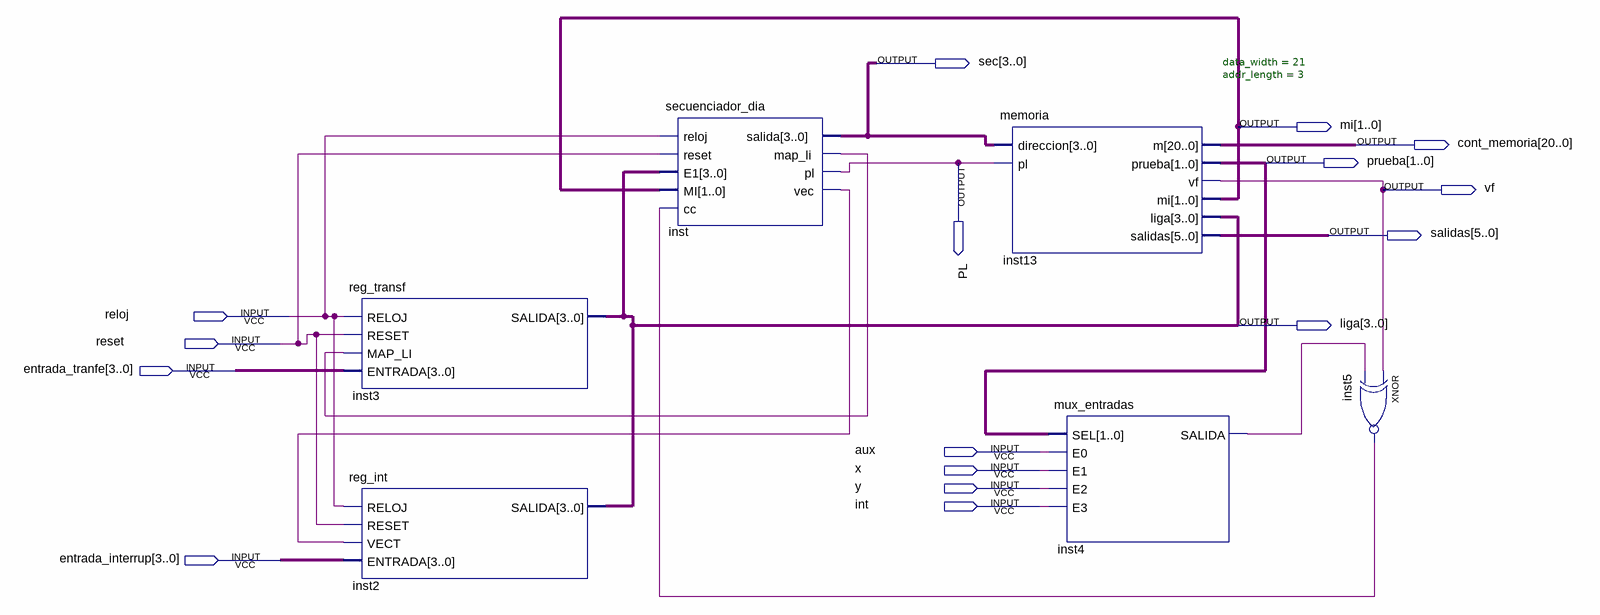
[diagram p0: schematic sheet]
// Quartus schematic practica_6.bdf as structural Verilog: 6 symbols, 16 pins
module practica_6 (
  input  reloj,
  input  reset,
  input  [3:0] entrada_tranfe,
  input  aux,
  input  x,
  input  y,
  input  \int ,
  input  [3:0] entrada_interrup,
  output [3:0] sec,
  output [1:0] mi,
  output [20:0] cont_memoria,
  output PL,
  output [1:0] prueba,
  output vf,
  output [5:0] salidas,
  output [3:0] liga
);

  wire inst4_salida, inst5_out, inst_map_li, inst_vec;

  reg_transf inst3 (.RELOJ(reloj), .RESET(reset), .MAP_LI(inst_map_li), .ENTRADA(entrada_tranfe), .SALIDA(liga));
  reg_int inst2 (.RELOJ(reloj), .RESET(reset), .VECT(inst_vec), .ENTRADA(entrada_interrup), .SALIDA(liga));
  secuenciador_dia inst (
    .reloj(reloj), .reset(reset), .E1(liga), .MI(mi), .cc(inst5_out), .salida(sec), .map_li(inst_map_li),
    .pl(PL), .vec(inst_vec));
  memoria #(.data_width(21), .addr_length(3)) inst13 (
    .direccion(sec), .pl(PL), .m(cont_memoria), .prueba(prueba), .vf(vf), .mi(mi), .liga(liga),
    .salidas(salidas));
  mux_entradas inst4 (.SEL(prueba), .E0(aux), .E1(x), .E2(y), .E3(\int ), .SALIDA(inst4_salida));
  xnor inst5 (inst5_out, vf, inst4_salida);
endmodule
